# EAGLE schematic eindwerk (EAGLE 6.5.0)
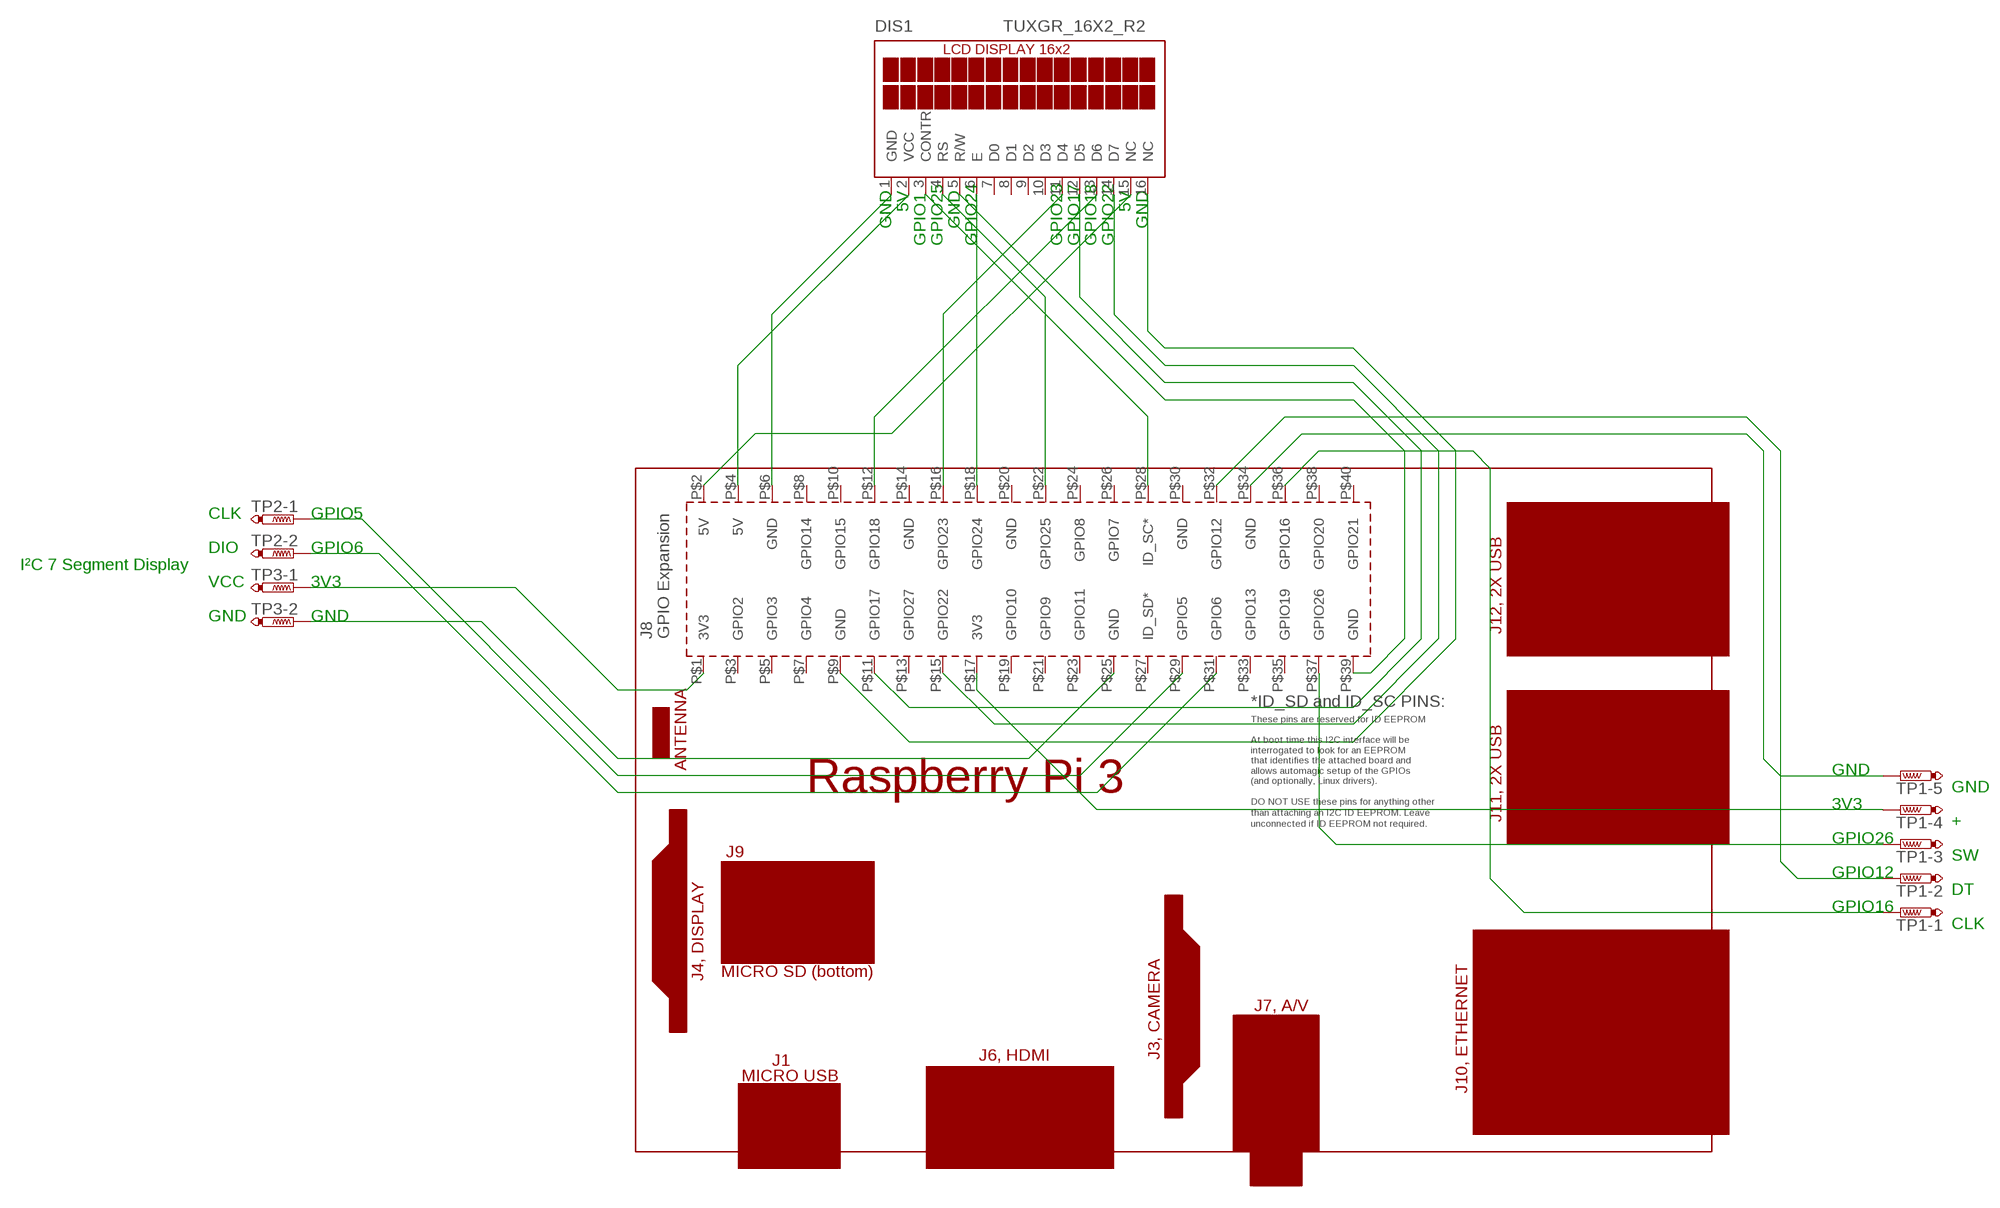
[diagram p0: schematic, sheet 1, part 1 of 2]
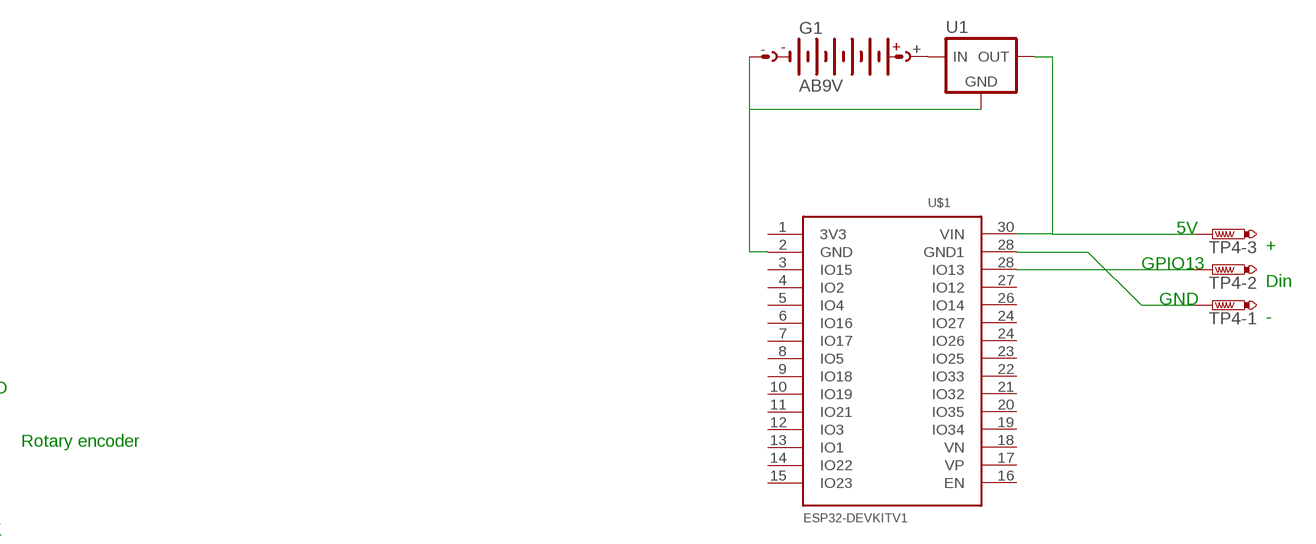
[diagram p1: schematic, sheet 1, part 2 of 2]

## Parts
DIS1  TUXGR_16X2_R2  [TUXGR_16X2_R2]
G1  AB9V  [AB9V]
PCB1  RPI3  [RPI3]
TP1  PTR5  [P5-25-17]
TP2  PTR2  [P2-38-17]
TP3  PTR2  [P2-38-17]
TP4  PTR5  [P5-25-17]
U1  78XX-TO220H-NH  [TO220BH-NH]
U$1  ESP32DEVKITV1  [ESP32-DEVKITV1]

## Nets
GND: G1.- U1.2(GND) U$1.2(GND)
N$1: DIS1.1(GND) PCB1.P$6(GND)
N$2: DIS1.2(VCC) PCB1.P$4(5V)
N$3: DIS1.3(CONTR) PCB1.P$28(ID_SC*)
N$4: DIS1.4(RS) PCB1.P$22(GPIO25)
N$5: DIS1.5(R/W) PCB1.P$39(GND)
N$6: DIS1.6(E) PCB1.P$18(GPIO24)
N$7: DIS1.11(D4) PCB1.P$16(GPIO23)
N$8: DIS1.12(D5) PCB1.P$11(GPIO17)
N$9: DIS1.13(D6) PCB1.P$12(GPIO18)
N$10: DIS1.14(D7) PCB1.P$15(GPIO22)
N$11: DIS1.15(NC) PCB1.P$2(5V)
N$12: DIS1.16(NC) PCB1.P$9(GND)
N$13: PCB1.P$1(3V3) TP3.TP-1
N$14: PCB1.P$25(GND) TP3.TP-2
N$15: PCB1.P$29(GPIO5) TP2.TP-1
N$16: PCB1.P$31(GPIO6) TP2.TP-2
N$17: PCB1.P$34(GND) TP1.TP-5
N$18: PCB1.P$17(3V3) TP1.TP-4
N$19: PCB1.P$32(GPIO12) TP1.TP-2
N$20: PCB1.P$36(GPIO16) TP1.TP-1
N$21: PCB1.P$37(GPIO26) TP1.TP-3
N$22: G1.+ U1.1(VIN)
N$23: TP4.TP-3 U1.3(VOUT) U$1.30(VIN)
N$24: TP4.TP-1 U$1.28(GND1)
N$25: TP4.TP-2 U$1.28(IO13)
Unconnected: DIS1.7(D0) DIS1.8(D1) DIS1.9(D2) DIS1.10(D3) PCB1.P$3(GPIO2) PCB1.P$5(GPIO3) PCB1.P$7(GPIO4) PCB1.P$8(GPIO14) PCB1.P$10(GPIO15) PCB1.P$13(GPIO27) PCB1.P$14(GND) PCB1.P$19(GPIO10) PCB1.P$20(GND) PCB1.P$21(GPIO9) PCB1.P$23(GPIO11) PCB1.P$24(GPIO8) PCB1.P$26(GPIO7) PCB1.P$27(ID_SD*) PCB1.P$30(GND) PCB1.P$33(GPIO13) PCB1.P$35(GPIO19) PCB1.P$38(GPIO20) PCB1.P$40(GPIO21) TP4.TP-4 TP4.TP-5 U$1.1(3V3) U$1.3(IO15) U$1.4(IO2) U$1.5(IO4) U$1.6(IO16) U$1.7(IO17) U$1.8(IO5) U$1.9(IO18) U$1.10(IO19) U$1.11(IO21) U$1.12(IO3) U$1.13(IO1) U$1.14(IO22) U$1.15(IO23) U$1.16(EN) U$1.17(VP) U$1.18(VN) U$1.19(IO34) U$1.20(IO35) U$1.21(IO32) U$1.22(IO33) U$1.23(IO25) U$1.24(IO26) U$1.24(IO27) U$1.26(IO14) U$1.27(IO12)

## Notes on the sheet
- 5V | 5V
- GND | GND | GND
- GPIO1 | GPIO25 | GPIO24 | GPIO23 | GPIO17 | GPIO18 | GPIO22
- CLK | GPIO5
- DIO | GPIO6
- I²C 7 Segment Display
- VCC | 3V3
- GND | GND
- 5V
- +
- GPIO13
- Din
- GND
- -
- GND
- GND
- 3V3
- +
- GPIO26 | Rotary encoder
- SW
- GPIO12
- DT
- GPIO16
- CLK

## Library data of the parts
DIS1 = display-lcd:TUXGR_16X2_R2: Tuxgraphics LCD display 16x2 characters reflective, without background light Source: tuxgr_12x2_r2.pdf; OC_FARNELL: unknown; OC_NEWARK: unknown
G1 = battery:AB9V: 9-V BATTERY CLIP
PCB1 = e14_Rpi3_RevA:RPI3: Device for Raspberry Pi 3 board created by Dave Young for www.element14.com More information and support community is available at https://www.element14.com/community/community/raspberry-pi
TP1 TP4 = testpad:PTR5: TEST PIN
TP2 TP3 = testpad:PTR2: TEST PIN
U1 = bt_regulator:78XX: 78XX Linear Voltage Regulator The venerable 7800-series Linear Voltage Regulator, including 7805, 7809, 7812, 7815, 7862 in 5 V, 6.2 V, 8.2 V, 9 V, 12 V, and 15 V, respectively Datasheets TI_LM78L05.pdf <http://www.ti.com/lit/ds/symlink/lm78l05.pdf> Fairchild_LM7805.pdf <https://www.fairchildsemi.com/datasheets/LM/LM7805.pdf>
U$1 = ESP32-DEVKITV1:ESP32DEVKITV1